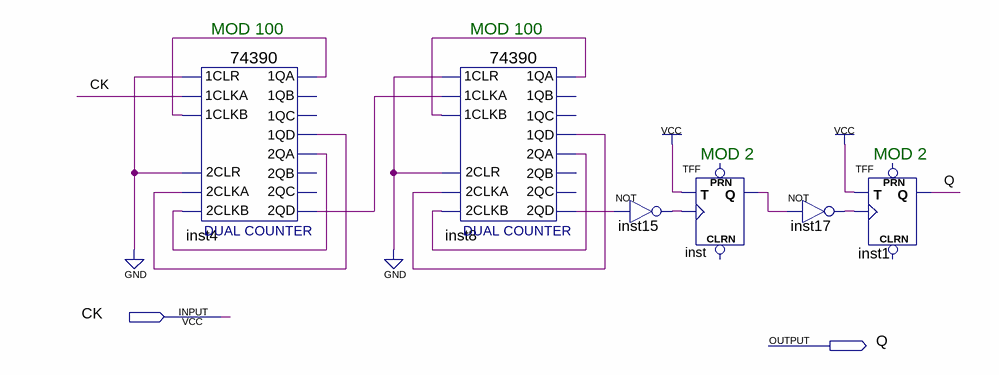
[diagram p0: schematic sheet]
// Quartus schematic 40000_MOD.bdf as structural Verilog: 6 symbols, 2 pins
module \40000_MOD  (
  input  CK,
  output Q
);

  wire inst4_1qa, inst4_1qd, inst4_2qa, inst4_2qd, inst8_1qa, inst8_1qd, inst8_2qa, inst8_2qd, inst15_out,
       inst17_out, inst_q;

  \74390  inst4 (
    .\2CLKA (inst4_1qd), .\2CLR (1'b0), .\2CLKB (inst4_2qa), .\1CLR (1'b0), .\1CLKA (CK),
    .\1CLKB (inst4_1qa), .\1QA (inst4_1qa), .\1QD (inst4_1qd), .\2QA (inst4_2qa), .\2QD (inst4_2qd));  // open: 1QB, 1QC, 2QB, 2QC
  \74390  inst8 (
    .\2CLKA (inst8_1qd), .\2CLR (1'b0), .\2CLKB (inst8_2qa), .\1CLR (1'b0), .\1CLKA (inst4_2qd),
    .\1CLKB (inst8_1qa), .\1QA (inst8_1qa), .\1QD (inst8_1qd), .\2QA (inst8_2qa), .\2QD (inst8_2qd));  // open: 1QB, 1QC, 2QB, 2QC
  not inst15 (inst15_out, inst8_2qd);
  TFF inst (.T(1'b1), .CLK(inst15_out), .Q(inst_q));  // open: PRN, CLRN
  not inst17 (inst17_out, inst_q);
  TFF inst1 (.T(1'b1), .CLK(inst17_out), .Q(Q));  // open: PRN, CLRN

  // Notes on the sheet:
  //   MOD 100
  //   MOD 100
  //   MOD 2
  //   MOD 2
endmodule
